# Altium schematic sheet Arduino_Uno_Custom_Schematic.SchDoc (part 3 of 4)
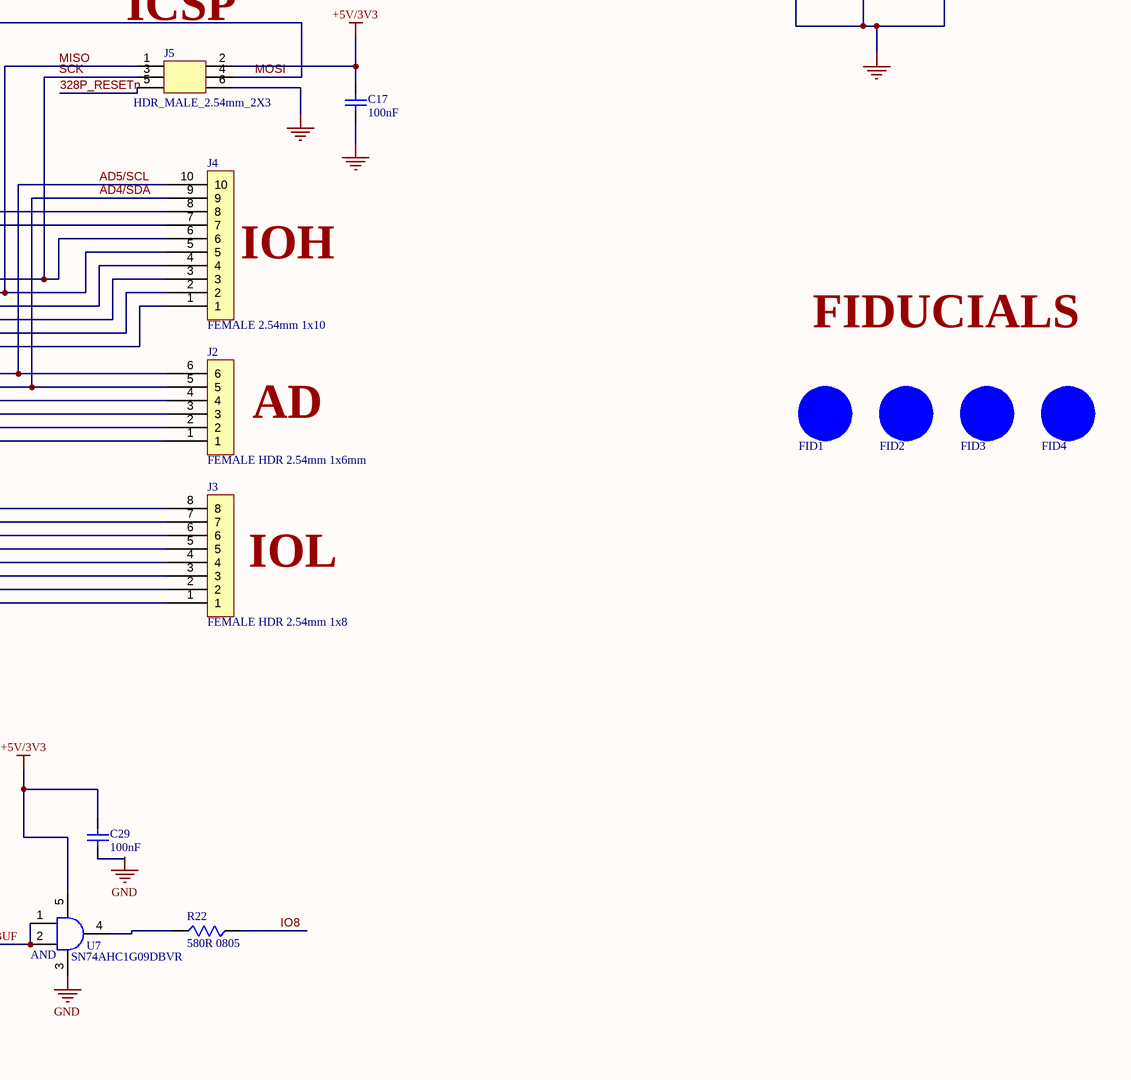
[diagram p5: Arduino_Uno_Custom_Schematic.SchDoc, bottom right]

## Library data of the parts (continued)
JP2 = 77313-124-04LF: Conn Unshrouded Header HDR 4 POS 2.54mm Solder ST Thru-Hole Poly Bag; Manufacturer: Amphenol Communications Solutions; Connector Type: Male Pin; Current Rating: 3A; Dielectric Material: Polyethylene; Gender: Male; Insulation Resistance: 5GΩ; Lead Length: 2.9mm; Mating Post Length: 6.75mm; Max Voltage Rating (AC): 1.5kV; Number of Contacts: 4; Plating Thickness: 762nm; Supplier: DigiKey; Supplier Part Number: 609-77313-124-04LF-ND; Manufacturer Part Number: 77313-124-04LF; RoHS: Compliant; Category: Card Edge Connectors; Stock: 15980; Pricing: 1=0.33, 10=0.283, 100=0.2406, 500=0.21476, 1000=0.2045, 5000=0.18253, 10000=0.17382 (USD); Color: Black; Contact Gender: Male; Contact Material: Bronze; Contact Mating Length: 6.7564mm; Contact Plating: Gold; Depth: 4.83mm; Export Control Classification Number (ECCN) Code: EAR99; Flammability Rating: UL94 V-0; Housing Color: Black; Housing Material: Thermoplastic; Harmonized Tariff Schedule (HTS) Code: 8536.69.40.40; Introduction Date: 2017-02-27; Lead Free: Lead Free; Length: 5.08mm; Lifecycle Status: Production; Material: Thermoplastic; Max Operating Temperature: 130°C; Min Operating Temperature: -65°C; Mounting Technology: Through Hole; Pins: 4; Number of Positions: 4; Number of Rows: 2; Orientation: Straight; Pitch: 2.54mm; Radiation Hardening: No; REACH SVHC: Yes; Row Spacing: 2.54mm; Terminal Pitch: 2.54mm; Termination: Solder; Voltage Rating: 1.5kV; ComponentLink1URL: https://datasheet.octopart.com:443/77313-124-04LF-Amphenol-Communications-Solutions-datasheet-154727349.pdf?src-supplier=IHS; ComponentLink1Description: https://datasheet.octopart.com:443/77313-124-04LF-Amphenol-Communications-Solutions-datasheet-154727349.pdf?src-supplier=IHS; ComponentLink2URL: https://datasheet.octopart.com:443/77313-124-04LF-FCI-datasheet-41338624.pdf?src-supplier=Newark; ComponentLink2Description: https://datasheet.octopart.com:443/77313-124-04LF-FCI-datasheet-41338624.pdf?src-supplier=Newark; ComponentLink3URL: https://datasheet.octopart.com:443/77313-124-04LF-Areva-datasheet-8461548.pdf?src-supplier=Newark; ComponentLink3Description: https://datasheet.octopart.com:443/77313-124-04LF-Areva-datasheet-8461548.pdf?src-supplier=Newark; ComponentLink4URL: https://datasheet.octopart.com:443/77313-124-04LF-Amphenol-Communications-Solutions-datasheet-168215136.pdf?src-supplier=TME; ComponentLink4Description: https://datasheet.octopart.com:443/77313-124-04LF-Amphenol-Communications-Solutions-datasheet-168215136.pdf?src-supplier=TME; ComponentLink5URL: https://datasheet.octopart.com:443/77313-124-04LF-FCI-datasheet-13533417.pdf?src-supplier=element14+APAC; ComponentLink5Description: https://datasheet.octopart.com:443/77313-124-04LF-FCI-datasheet-13533417.pdf?src-supplier=element14+APAC; ComponentLink6URL: https://datasheet.octopart.com:443/77313-124-04LF-Areva-datasheet-118936.pdf?src-supplier=DigiKey; ComponentLink6Description: https://datasheet.octopart.com:443/77313-124-04LF-Areva-datasheet-118936.pdf?src-supplier=DigiKey
JP3 = 68001-104HLF: Conn Unshrouded Header HDR 4 POS 2.54mm Solder ST Top Entry Thru-Hole BERGSTIK® Bulk; Manufacturer: Amphenol Communications Solutions; Connector Type: Male Pin; Current Rating: 3A; Gender: Male; Insulation Resistance: 5GΩ; Lead Length: 3.05mm; Mating Post Length: 5.84mm; Max Voltage Rating (AC): 1.5kV; Number of Contacts: 4; Supplier: DigiKey; Supplier Part Number: 609-3271-ND; Manufacturer Part Number: 68001-104HLF; RoHS: Compliant; Category: Card Edge Connectors; Stock: 16450; Pricing: 1=0.43, 10=0.361, 100=0.307, 500=0.27402, 1000=0.26093, 5000=0.23291, 10000=0.2218 (USD); China RoHS: Compliant; Color: Black; Contact Gender: Male; Contact Material: Bronze; Contact Mating Length: 5.842mm; Contact Plating: Gold; Depth: 2.41mm; Housing Color: Black; Housing Material: Thermoplastic; Lead Pitch: 2.54mm; Length: 10.16mm; Lifecycle Status: Production; Max Operating Temperature: 130°C; Min Operating Temperature: -65°C; Mounting Technology: Through Hole; Pins: 4; Number of Positions: 4; Number of Rows: 1; Orientation: Straight; Pitch: 2.54mm; Radiation Hardening: No; REACH SVHC: Yes; Terminal Pitch: 2.54mm; Termination: Solder; Voltage Rating: 1.5kV; ComponentLink1URL: https://datasheet.octopart.com:443/68001-104HLF-Amphenol-Communications-Solutions-datasheet-151206381.pdf?src-supplier=IHS; ComponentLink1Description: https://datasheet.octopart.com:443/68001-104HLF-Amphenol-Communications-Solutions-datasheet-151206381.pdf?src-supplier=IHS; ComponentLink2URL: https://datasheet.octopart.com:443/68001-104HLF-Areva-datasheet-8449737.pdf?src-supplier=Farnell; ComponentLink2Description: https://datasheet.octopart.com:443/68001-104HLF-Areva-datasheet-8449737.pdf?src-supplier=Farnell; ComponentLink3URL: https://datasheet.octopart.com:443/68001-104HLF-Amphenol-Communications-Solutions-datasheet-41232361.pdf?src-supplier=Farnell; ComponentLink3Description: https://datasheet.octopart.com:443/68001-104HLF-Amphenol-Communications-Solutions-datasheet-41232361.pdf?src-supplier=Farnell; ComponentLink4URL: https://datasheet.octopart.com:443/68001-104HLF-Areva-datasheet-10088795.pdf?src-supplier=Farnell; ComponentLink4Description: https://datasheet.octopart.com:443/68001-104HLF-Areva-datasheet-10088795.pdf?src-supplier=Farnell; ComponentLink5URL: https://datasheet.octopart.com:443/68001-104HLF-Areva-datasheet-8861575.pdf?src-supplier=Farnell; ComponentLink5Description: https://datasheet.octopart.com:443/68001-104HLF-Areva-datasheet-8861575.pdf?src-supplier=Farnell; ComponentLink6URL: https://datasheet.octopart.com:443/68001-104HLF-Areva-datasheet-8713716.pdf?src-supplier=Farnell; ComponentLink6Description: https://datasheet.octopart.com:443/68001-104HLF-Areva-datasheet-8713716.pdf?src-supplier=Farnell; ComponentLink7URL: https://datasheet.octopart.com:443/68001-104HLF-Amphenol-Communications-Solutions-datasheet-154727322.pdf?src-supplier=Electro+Sonic; ComponentLink7Description: https://datasheet.octopart.com:443/68001-104HLF-Amphenol-Communications-Solutions-datasheet-154727322.pdf?src-supplier=Electro+Sonic; ComponentLink8URL: https://datasheet.octopart.com:443/68001-104HLF-Amphenol-Communications-Solutions-datasheet-100449246.pdf?src-supplier=Future+Electronics; ComponentLink8Description: https://datasheet.octopart.com:443/68001-104HLF-Amphenol-Communications-Solutions-datasheet-100449246.pdf?src-supplier=Future+Electronics; ComponentLink9URL: https://datasheet.octopart.com:443/68001-104HLF-Amphenol-Communications-Solutions-datasheet-20739493.pdf?src-supplier=RS+(Formerly+Allied+Electronics); ComponentLink9Description: https://datasheet.octopart.com:443/68001-104HLF-Amphenol-Communications-Solutions-datasheet-20739493.pdf?src-supplier=RS+(Formerly+Allied+Electronics)
L1 = CIGT252008LM2R2MNE: ROHS3Compliant Thin Film Active WRAPAROUND Fixed Inductor -40C~125C 1MHz 97mOhm Max 2.2muH; Manufacturer: Samsung Electro-Mechanics; DC Resistance (DCR): 97mΩ; Value: 2.2µH; Number of Circuits: 1; Shielding: Unshielded; Tolerance: 20%; Supplier: DigiKey; Supplier Part Number: 1276-6925-6-ND; Manufacturer Part Number: CIGT252008LM2R2MNE; RoHS: Compliant; Category: Fixed Inductors; Stock: 51920; Pricing: 1=0.19, 10=0.159, 100=0.1306, 1000=0.10743 (USD); Lifecycle Status: Production; Max Current Rating: 2A; Max Operating Temperature: 125°C; Min Operating Temperature: -40°C; Number of Terminals: 2; REACH SVHC: Yes; Test Frequency: 1MHz; ComponentLink1URL: https://datasheet.octopart.com:443/CIGT252008LM2R2MNE-Samsung-Electro-Mechanics-datasheet-181233562.pdf?src-supplier=IHS; ComponentLink1Description: https://datasheet.octopart.com:443/CIGT252008LM2R2MNE-Samsung-Electro-Mechanics-datasheet-181233562.pdf?src-supplier=IHS; ComponentLink2URL: https://datasheet.octopart.com:443/CIGT252008LM2R2MNE-Samsung-Electro-Mechanics-datasheet-168494664.pdf?src-supplier=Future+Electronics; ComponentLink2Description: https://datasheet.octopart.com:443/CIGT252008LM2R2MNE-Samsung-Electro-Mechanics-datasheet-168494664.pdf?src-supplier=Future+Electronics
LINK1-LINK3 = QPC02SXGN-RC: 2 Position 2.54 mm Centerline Single Circuit Open Top Jumper; Manufacturer: Sullins; Current Rating: 3A; Gender: Female; Number of Contacts: 2; Number of Positions: 1; Pitch: 2.54mm; Supplier: DigiKey; Supplier Part Number: S9337-ND; Manufacturer Part Number: QPC02SXGN-RC; RoHS: Compliant; Category: Shunts and Jumpers; Stock: 1813576; Pricing: 1=0.1, 10=0.028, 25=0.026, 50=0.025, 100=0.0237, 250=0.02224, 500=0.02116, 2000=0.01918, 4000=0.01826 (USD); Case/Package: 100; Contact Material: Brass; Contact Plating: Gold; Height: 6.17mm; Lead Free: Lead Free; Lifecycle Status: Production; Max Operating Temperature: 85°C; Min Operating Temperature: -40°C; Orientation: Straight; Packaging: Bulk; REACH SVHC: Yes; ComponentLink1URL: https://datasheet.octopart.com:443/QPC02SXGN-RC-Sullins-datasheet-138898435.pdf?src-supplier=ODG+(Origin+Data+Global); ComponentLink1Description: https://datasheet.octopart.com:443/QPC02SXGN-RC-Sullins-datasheet-138898435.pdf?src-supplier=ODG+(Origin+Data+Global); ComponentLink2URL: https://datasheet.octopart.com:443/QPC02SXGN-RC-Sullins-datasheet-12521006.pdf?src-supplier=IHS; ComponentLink2Description: https://datasheet.octopart.com:443/QPC02SXGN-RC-Sullins-datasheet-12521006.pdf?src-supplier=IHS; ComponentLink3URL: https://sigma.octopart.com:443/138898456/technical_drawing/Sullins-QPC02SXGN-RC.pdf?src-supplier=Upverter; ComponentLink3Description: https://sigma.octopart.com:443/138898456/technical_drawing/Sullins-QPC02SXGN-RC.pdf?src-supplier=Upverter; ComponentLink4URL: https://datasheet.octopart.com:443/QPC02SXGN-RC-Sullins-datasheet-41399305.pdf?src-supplier=Future+Electronics; ComponentLink4Description: https://datasheet.octopart.com:443/QPC02SXGN-RC-Sullins-datasheet-41399305.pdf?src-supplier=Future+Electronics
MH1-MH3 = MH_7.4MMC_3.2MMD: Mounting Hole, 7.4mm Dia, 3.2mm Drill
MH4 = MH_7.4MMNC_3.2MMD: Mounting Hole 7.4mm (non-copper), 3.2 drill NPTH
R1 = AC0805FR-13100KL: Res Thick Film 0805 100K Ohm 1% 0.125W(1/8W) ±100ppm/C Pad SMD T/R Automotive AEC-Q200; Manufacturer: Yageo Group; Power Rating: 125mW; Value: 100kΩ; Temperature Coefficient: 100ppm/°C; Voltage Rating: 150V; Supplier: DigiKey; Supplier Part Number: 13-AC0805FR-13100KLCT-ND; Manufacturer Part Number: AC0805FR-13100KL; RoHS: Compliant; Category: Chip SMD Resistors; Stock: 276323; Pricing: 1=0.1, 10=0.037, 25=0.028, 50=0.0228, 100=0.0188, 250=0.01484, 500=0.0126, 1000=0.01083, 5000=0.00803 (USD); Case/Package: 0805; China RoHS: Non-Compliant; Composition: Thick Film; Country of Origin: Mainland China, Taiwan; Depth: 1.25mm; Export Control Classification Number (ECCN) Code: EAR99; Height: 500µm; Harmonized Tariff Schedule (HTS) Code: 8533.21.00.30; Introduction Date: 2012-04-10; Length: 2mm; Lifecycle Status: Production; Max Operating Temperature: 155°C; Military Standard: Not; Min Operating Temperature: -55°C; Mounting Technology: Surface Mount; Number of Terminals: 2; Ratings: AEC-Q200; REACH SVHC: Yes; Tolerance: 1%; Width: 1.25mm; Working Voltage: 150V; ComponentLink1URL: https://datasheet.octopart.com:443/AC0805FR-13100KL-Yageo-datasheet-182189377.pdf?src-supplier=IHS; ComponentLink1Description: https://datasheet.octopart.com:443/AC0805FR-13100KL-Yageo-datasheet-182189377.pdf?src-supplier=IHS; ComponentLink2URL: https://datasheet.octopart.com:443/AC0805FR-13100KL-Yageo-datasheet-83209224.pdf?src-supplier=Upverter; ComponentLink2Description: https://datasheet.octopart.com:443/AC0805FR-13100KL-Yageo-datasheet-83209224.pdf?src-supplier=Upverter; ComponentLink3URL: https://datasheet.octopart.com:443/AC0805FR-13100KL-Yageo-datasheet-178509465.pdf?src-supplier=Newark; ComponentLink3Description: https://datasheet.octopart.com:443/AC0805FR-13100KL-Yageo-datasheet-178509465.pdf?src-supplier=Newark; ComponentLink4URL: https://datasheet.octopart.com:443/AC0805FR-13100KL-Yageo-datasheet-166720450.pdf?src-supplier=Future+Electronics; ComponentLink4Description: https://datasheet.octopart.com:443/AC0805FR-13100KL-Yageo-datasheet-166720450.pdf?src-supplier=Future+Electronics; ComponentLink5URL: https://datasheet.octopart.com:443/AC0805FR-13100KL-Yageo-datasheet-151884373.pdf?src-supplier=Future+Electronics; ComponentLink5Description: https://datasheet.octopart.com:443/AC0805FR-13100KL-Yageo-datasheet-151884373.pdf?src-supplier=Future+Electronics; ComponentLink6URL: https://datasheet.octopart.com:443/AC0805FR-13100KL-Yageo-datasheet-137699919.pdf?src-supplier=Future+Electronics; ComponentLink6Description: https://datasheet.octopart.com:443/AC0805FR-13100KL-Yageo-datasheet-137699919.pdf?src-supplier=Future+Electronics; ComponentLink7URL: https://datasheet.octopart.com/AC0805FR-13100KL-Yageo-datasheet-12512238.pdf; ComponentLink7Description: https://datasheet.octopart.com/AC0805FR-13100KL-Yageo-datasheet-12512238.pdf; ComponentLink8URL: http://sigma.octopart.com:80/conflict_mineral_statement/Yageo-company-3.pdf?src-supplier=Compliance+Statements; ComponentLink8Description: http://sigma.octopart.com:80/conflict_mineral_statement/Yageo-company-3.pdf?src-supplier=Compliance+Statements; ComponentLink9URL: http://sigma.octopart.com:80/rohs_statement/Yageo-company-2.pdf?src-supplier=Compliance+Statements; ComponentLink9Description: http://sigma.octopart.com:80/rohs_statement/Yageo-company-2.pdf?src-supplier=Compliance+Statements
R2 R3 R15 R17 R22 = AC0805FR-07560RL: Res Thick Film 0805 560 Ohm 1% 0.125W(1/8W) ±100ppm/C Pad SMD Automotive T/R; Manufacturer: Yageo Group; Manufacturer Package Identifier: 0805 (2012 metric); Max Power Dissipation: 125mW; Value: 560Ω; Temperature Coefficient: 100ppm/°C; Voltage Rating: 150V; Supplier: DigiKey; Supplier Part Number: YAG3743DKR-ND; Manufacturer Part Number: AC0805FR-07560RL; RoHS: Compliant; Category: Chip SMD Resistors; Stock: 36111; Pricing: 1=0.1, 10=0.037, 25=0.028, 50=0.0228, 100=0.0188, 250=0.01484, 500=0.0126, 1000=0.01083 (USD); Case/Package: 0805; Case Code (Imperial): 0805; Case Code (Metric): 2012; China RoHS: Non-Compliant; Composition: Thick Film; Features: Automotive AEC-Q200, Moisture Resistant; Height: 500µm; Length: 2mm; Lifecycle Status: Production; Max Operating Temperature: 155°C; Min Operating Temperature: -55°C; Mounting Technology: Surface Mount; Number of Terminals: 2; Number of Terminations: 2; Packaging: Tape & Reel; Power Rating: 125mW; Ratings: AEC-Q200; REACH SVHC: Yes; Schedule B: 8533210045, 8533210045|8533210045, 8533210045|8533210045|8533210045, 8533210045|8533210045|8533210045|8533210045; Termination: SMD/SMT; Tolerance: 1%; Weight: 5.499807mg; Width: 1.25mm; Working Voltage: 150V; ComponentLink1URL: https://datasheet.octopart.com:443/AC0805FR-07560RL-Yageo-datasheet-182189377.pdf?src-supplier=IHS; ComponentLink1Description: https://datasheet.octopart.com:443/AC0805FR-07560RL-Yageo-datasheet-182189377.pdf?src-supplier=IHS; ComponentLink2URL: https://datasheet.octopart.com:443/AC0805FR-07560RL-Yageo-datasheet-83209224.pdf?src-supplier=Upverter; ComponentLink2Description: https://datasheet.octopart.com:443/AC0805FR-07560RL-Yageo-datasheet-83209224.pdf?src-supplier=Upverter; ComponentLink3URL: https://datasheet.octopart.com:443/AC0805FR-07560RL-Yageo-datasheet-178509465.pdf?src-supplier=Newark; ComponentLink3Description: https://datasheet.octopart.com:443/AC0805FR-07560RL-Yageo-datasheet-178509465.pdf?src-supplier=Newark; ComponentLink4URL: https://datasheet.octopart.com:443/AC0805FR-07560RL-Yageo-Group-datasheet-188689268.pdf?src-supplier=LCSC; ComponentLink4Description: https://datasheet.octopart.com:443/AC0805FR-07560RL-Yageo-Group-datasheet-188689268.pdf?src-supplier=LCSC; ComponentLink5URL: https://datasheet.octopart.com:443/AC0805FR-07560RL-Yageo-datasheet-166720450.pdf?src-supplier=Future+Electronics; ComponentLink5Description: https://datasheet.octopart.com:443/AC0805FR-07560RL-Yageo-datasheet-166720450.pdf?src-supplier=Future+Electronics; ComponentLink6URL: https://datasheet.octopart.com:443/AC0805FR-07560RL-Yageo-datasheet-151884373.pdf?src-supplier=Future+Electronics; ComponentLink6Description: https://datasheet.octopart.com:443/AC0805FR-07560RL-Yageo-datasheet-151884373.pdf?src-supplier=Future+Electronics; ComponentLink7URL: https://datasheet.octopart.com:443/AC0805FR-07560RL-Yageo-datasheet-137699919.pdf?src-supplier=Future+Electronics; ComponentLink7Description: https://datasheet.octopart.com:443/AC0805FR-07560RL-Yageo-datasheet-137699919.pdf?src-supplier=Future+Electronics; ComponentLink8URL: https://datasheet.octopart.com:443/AC0805FR-07560RL-Yageo-datasheet-86786639.pdf?src-supplier=Future+Electronics; ComponentLink8Description: https://datasheet.octopart.com:443/AC0805FR-07560RL-Yageo-datasheet-86786639.pdf?src-supplier=Future+Electronics; ComponentLink9URL: https://datasheet.octopart.com:443/AC0805FR-07560RL-Yageo-datasheet-159083007.pdf?src-supplier=TME; ComponentLink9Description: https://datasheet.octopart.com:443/AC0805FR-07560RL-Yageo-datasheet-159083007.pdf?src-supplier=TME; ComponentLink10URL: https://datasheet.octopart.com:443/AC0805FR-07560RL-Yageo-datasheet-128680628.pdf?src-supplier=X-ON; ComponentLink10Description: https://datasheet.octopart.com:443/AC0805FR-07560RL-Yageo-datasheet-128680628.pdf?src-supplier=X-ON; ComponentLink11URL: https://datasheet.octopart.com/AC0805FR-07560RL-Yageo-datasheet-12512238.pdf; ComponentLink11Description: https://datasheet.octopart.com/AC0805FR-07560RL-Yageo-datasheet-12512238.pdf; ComponentLink12URL: http://sigma.octopart.com:80/conflict_mineral_statement/Yageo-company-3.pdf?src-supplier=Compliance+Statements; ComponentLink12Description: http://sigma.octopart.com:80/conflict_mineral_statement/Yageo-company-3.pdf?src-supplier=Compliance+Statements; ComponentLink13URL: http://sigma.octopart.com:80/rohs_statement/Yageo-company-2.pdf?src-supplier=Compliance+Statements; ComponentLink13Description: http://sigma.octopart.com:80/rohs_statement/Yageo-company-2.pdf?src-supplier=Compliance+Statements
R4 R14 R18-R21 = RC0805FR-0710KL: Res Thick Film 0805 10K Ohm 1% 0.125W(1/8W) +/-100ppm/C Epoxy Pad SMD T/R; Manufacturer: Yageo Group; Max Power Dissipation: 125mW; Value: 10kΩ; Temperature Coefficient: 100ppm/°C; Voltage Rating: 150V; Supplier: DigiKey; Supplier Part Number: 311-10.0KCRCT-ND; Manufacturer Part Number: RC0805FR-0710KL; RoHS: Compliant; Category: Chip SMD Resistors; Stock: 2846345; Pricing: 1=0.13, 10=0.009, 25=0.0088, 50=0.0082 (USD); Case/Package: 0805; Case Code (Imperial): 0805; China RoHS: Non-Compliant; Composition: Thick Film; Country of Origin: Mainland China, Taiwan; Depth: 1.25mm; Export Control Classification Number (ECCN) Code: EAR99; Features: Moisture Resistant; Height: 500µm; Harmonized Tariff Schedule (HTS) Code: 8533.21.00.30; Introduction Date: 2004-09-22; Lead Free: Lead Free; Length: 2mm; Lifecycle Status: Production; Max Operating Temperature: 155°C; Military Standard: Not; Min Operating Temperature: -55°C; Mounting Technology: Surface Mount; Pins: 2; Number of Terminals: 2; Number of Terminations: 2; Packaging: Tape and Reel; Power Dissipation: 125mW; Power Rating: 125mW; REACH SVHC: Yes; Schedule B: 8533210045, 8533210045|8533210045|8533210045|8533210045|8533210045|8533210045|8533210045|8533210045|8533210045|8533210045|8533210045|8533210045|8533210045|8533210045|8533210045|8533210045|8533210045|8533210045|8533210045|8533210045|8533210045|8533210045|8533210045|85; Termination: SMD/SMT; Tolerance: 1%; Voltage Rating (AC): 150V; Width: 1.25mm; Working Voltage: 150V; ComponentLink1URL: https://datasheet.octopart.com:443/RC0805FR-0710KL-Yageo-datasheet-175887523.pdf?src-supplier=Newark; ComponentLink1Description: https://datasheet.octopart.com:443/RC0805FR-0710KL-Yageo-datasheet-175887523.pdf?src-supplier=Newark; ComponentLink2URL: https://datasheet.octopart.com:443/RC0805FR-0710KL-Yageo-datasheet-62067350.pdf?src-supplier=Farnell; ComponentLink2Description: https://datasheet.octopart.com:443/RC0805FR-0710KL-Yageo-datasheet-62067350.pdf?src-supplier=Farnell; ComponentLink3URL: https://datasheet.octopart.com:443/RC0805FR-0710KL-Yageo-datasheet-13691069.pdf?src-supplier=Farnell; ComponentLink3Description: https://datasheet.octopart.com:443/RC0805FR-0710KL-Yageo-datasheet-13691069.pdf?src-supplier=Farnell; ComponentLink4URL: https://datasheet.octopart.com:443/RC0805FR-0710KL-Yageo-datasheet-103092701.pdf?src-supplier=Upverter; ComponentLink4Description: https://datasheet.octopart.com:443/RC0805FR-0710KL-Yageo-datasheet-103092701.pdf?src-supplier=Upverter; ComponentLink5URL: https://datasheet.octopart.com:443/RC0805FR-0710KL-Yageo-datasheet-98239111.pdf?src-supplier=Upverter; ComponentLink5Description: https://datasheet.octopart.com:443/RC0805FR-0710KL-Yageo-datasheet-98239111.pdf?src-supplier=Upverter; ComponentLink6URL: https://datasheet.octopart.com:443/RC0805FR-0710KL-Yageo---Phycomp-datasheet-67302840.pdf?src-supplier=Upverter; ComponentLink6Description: https://datasheet.octopart.com:443/RC0805FR-0710KL-Yageo---Phycomp-datasheet-67302840.pdf?src-supplier=Upverter; ComponentLink7URL: https://datasheet.octopart.com:443/RC0805FR-0710KL-Yageo-datasheet-8330313.pdf?src-supplier=element14+APAC; ComponentLink7Description: https://datasheet.octopart.com:443/RC0805FR-0710KL-Yageo-datasheet-8330313.pdf?src-supplier=element14+APAC; ComponentLink8URL: https://datasheet.octopart.com:443/RC0805FR-0710KL-Yageo-datasheet-12592811.pdf?src-supplier=element14+APAC; ComponentLink8Description: https://datasheet.octopart.com:443/RC0805FR-0710KL-Yageo-datasheet-12592811.pdf?src-supplier=element14+APAC; ComponentLink9URL: https://datasheet.octopart.com:443/RC0805FR-0710KL-Yageo-Group-datasheet-190305687.pdf?src-supplier=Future+Electronics; ComponentLink9Description: https://datasheet.octopart.com:443/RC0805FR-0710KL-Yageo-Group-datasheet-190305687.pdf?src-supplier=Future+Electronics; ComponentLink10URL: https://datasheet.octopart.com:443/RC0805FR-0710KL-Yageo-datasheet-164759695.pdf?src-supplier=Future+Electronics; ComponentLink10Description: https://datasheet.octopart.com:443/RC0805FR-0710KL-Yageo-datasheet-164759695.pdf?src-supplier=Future+Electronics; ComponentLink11URL: https://datasheet.octopart.com:443/RC0805FR-0710KL-Yageo-datasheet-15800360.pdf?src-supplier=Future+Electronics; ComponentLink11Description: https://datasheet.octopart.com:443/RC0805FR-0710KL-Yageo-datasheet-15800360.pdf?src-supplier=Future+Electronics; ComponentLink12URL: https://datasheet.octopart.com:443/RC0805FR-0710KL-Yageo-datasheet-8324252.pdf?src-supplier=Future+Electronics; ComponentLink12Description: https://datasheet.octopart.com:443/RC0805FR-0710KL-Yageo-datasheet-8324252.pdf?src-supplier=Future+Electronics; ComponentLink13URL: https://datasheet.octopart.com:443/RC0805FR-0710KL-Yageo-datasheet-79472498.pdf?src-supplier=Megastar; ComponentLink13Description: https://datasheet.octopart.com:443/RC0805FR-0710KL-Yageo-datasheet-79472498.pdf?src-supplier=Megastar; ComponentLink14URL: https://datasheet.octopart.com:443/RC0805FR-0710KL-Yageo-datasheet-27714392.pdf?src-supplier=Seeed+Studio; ComponentLink14Description: https://datasheet.octopart.com:443/RC0805FR-0710KL-Yageo-datasheet-27714392.pdf?src-supplier=Seeed+Studio; ComponentLink15URL: https://datasheet.octopart.com/RC0805FR-0710KL-Yageo-datasheet-73766026.pdf; ComponentLink15Description: https://datasheet.octopart.com/RC0805FR-0710KL-Yageo-datasheet-73766026.pdf; ComponentLink16URL: https://datasheet.octopart.com:443/RC0805FR-0710KL-Yageo-datasheet-118657.pdf?src-supplier=DigiKey; ComponentLink16Description: https://datasheet.octopart.com:443/RC0805FR-0710KL-Yageo-datasheet-118657.pdf?src-supplier=DigiKey; ComponentLink17URL: https://datasheet.octopart.com:443/RC0805FR-0710KL-Yageo-datasheet-502840.pdf?src-supplier=element14; ComponentLink17Description: https://datasheet.octopart.com:443/RC0805FR-0710KL-Yageo-datasheet-502840.pdf?src-supplier=element14; ComponentLink18URL: http://sigma.octopart.com:80/conflict_mineral_statement/Yageo-company-3.pdf?src-supplier=Compliance+Statements; ComponentLink18Description: http://sigma.octopart.com:80/conflict_mineral_statement/Yageo-company-3.pdf?src-supplier=Compliance+Statements; ComponentLink19URL: http://sigma.octopart.com:80/rohs_statement/Yageo-company-2.pdf?src-supplier=Compliance+Statements; ComponentLink19Description: http://sigma.octopart.com:80/rohs_statement/Yageo-company-2.pdf?src-supplier=Compliance+Statements
R5-R7 R13 R23-R25 = RC0805FR-0722RL: 125mW Thick Film Resistors 150V ±100ppm/℃ ±1% 22Ω 0805 Chip Resistor - Surface Mount ROHS; Manufacturer: Yageo Group; Temperature Coefficient: 100ppm/°C; Supplier: DigiKey; Supplier Part Number: 311-22.0CRCT-ND; Manufacturer Part Number: RC0805FR-0722RL; RoHS: Compliant; Category: Chip SMD Resistors; Stock: 96991; Pricing: 1=0.17, 10=0.015, 25=0.0128, 50=0.0102, 100=0.0092, 250=0.00828 (USD); Case/Package: 0805; Case Code (Imperial): 0805; China RoHS: Non-Compliant; Composition: Thick Film; Country of Origin: Mainland China, Taiwan; Depth: 1.25mm; Export Control Classification Number (ECCN) Code: EAR99; Features: Moisture Resistant; Height: 500µm; Harmonized Tariff Schedule (HTS) Code: 8533.21.00.30; Introduction Date: 2004-09-22; Lead Free: Lead Free; Length: 2mm; Lifecycle Status: Production; Max Operating Temperature: 155°C; Max Power Dissipation: 125mW; Military Standard: Not; Min Operating Temperature: -55°C; Mounting Technology: Surface Mount; Pins: 2; Number of Terminals: 2; Number of Terminations: 2; Packaging: Tape & Reel; Power Dissipation: 125mW; Power Rating: 125mW; REACH SVHC: Yes; Value: 22Ω; Schedule B: 8533210045, 8533210045|8533210045, 8533210045|8533210045|8533210045, 8533210045|8533210045|8533210045|8533210045; Termination: SMD/SMT; Tolerance: 1%; Voltage Rating: 150V; Voltage Rating (AC): 150V; Voltage Rating (DC): 150V; Width: 1.25mm; Working Voltage: 150V; ComponentLink1URL: https://datasheet.octopart.com:443/RC0805FR-0722RL-Yageo-datasheet-175887523.pdf?src-supplier=IHS; ComponentLink1Description: https://datasheet.octopart.com:443/RC0805FR-0722RL-Yageo-datasheet-175887523.pdf?src-supplier=IHS; ComponentLink2URL: https://datasheet.octopart.com:443/RC0805FR-0722RL-Yageo-datasheet-103092701.pdf?src-supplier=Upverter; ComponentLink2Description: https://datasheet.octopart.com:443/RC0805FR-0722RL-Yageo-datasheet-103092701.pdf?src-supplier=Upverter; ComponentLink3URL: https://datasheet.octopart.com:443/RC0805FR-0722RL-Yageo-datasheet-79472498.pdf?src-supplier=Upverter; ComponentLink3Description: https://datasheet.octopart.com:443/RC0805FR-0722RL-Yageo-datasheet-79472498.pdf?src-supplier=Upverter; ComponentLink4URL: https://datasheet.octopart.com:443/RC0805FR-0722RL-Yageo-datasheet-8330313.pdf?src-supplier=element14+APAC; ComponentLink4Description: https://datasheet.octopart.com:443/RC0805FR-0722RL-Yageo-datasheet-8330313.pdf?src-supplier=element14+APAC; ComponentLink5URL: https://datasheet.octopart.com:443/RC0805FR-0722RL-Yageo-datasheet-62067350.pdf?src-supplier=element14+APAC; ComponentLink5Description: https://datasheet.octopart.com:443/RC0805FR-0722RL-Yageo-datasheet-62067350.pdf?src-supplier=element14+APAC; ComponentLink6URL: https://datasheet.octopart.com:443/RC0805FR-0722RL-Yageo-Group-datasheet-176638170.pdf?src-supplier=Future+Electronics; ComponentLink6Description: https://datasheet.octopart.com:443/RC0805FR-0722RL-Yageo-Group-datasheet-176638170.pdf?src-supplier=Future+Electronics; ComponentLink7URL: https://datasheet.octopart.com:443/RC0805FR-0722RL-Yageo-datasheet-164759695.pdf?src-supplier=Future+Electronics; ComponentLink7Description: https://datasheet.octopart.com:443/RC0805FR-0722RL-Yageo-datasheet-164759695.pdf?src-supplier=Future+Electronics; ComponentLink8URL: https://datasheet.octopart.com:443/RC0805FR-0722RL-Yageo-datasheet-12592811.pdf?src-supplier=Future+Electronics; ComponentLink8Description: https://datasheet.octopart.com:443/RC0805FR-0722RL-Yageo-datasheet-12592811.pdf?src-supplier=Future+Electronics; ComponentLink9URL: https://datasheet.octopart.com:443/RC0805FR-0722RL-Yageo-datasheet-8324252.pdf?src-supplier=Future+Electronics; ComponentLink9Description: https://datasheet.octopart.com:443/RC0805FR-0722RL-Yageo-datasheet-8324252.pdf?src-supplier=Future+Electronics; ComponentLink10URL: https://datasheet.octopart.com/RC0805FR-0722RL-Yageo-datasheet-73766026.pdf; ComponentLink10Description: https://datasheet.octopart.com/RC0805FR-0722RL-Yageo-datasheet-73766026.pdf; ComponentLink11URL: https://datasheet.octopart.com:443/RC0805FR-0722RL-Yageo-datasheet-13691069.pdf?src-supplier=Farnell; ComponentLink11Description: https://datasheet.octopart.com:443/RC0805FR-0722RL-Yageo-datasheet-13691069.pdf?src-supplier=Farnell; ComponentLink12URL: https://datasheet.octopart.com:443/RC0805FR-0722RL-Yageo-datasheet-118657.pdf?src-supplier=DigiKey; ComponentLink12Description: https://datasheet.octopart.com:443/RC0805FR-0722RL-Yageo-datasheet-118657.pdf?src-supplier=DigiKey; ComponentLink13URL: http://sigma.octopart.com:80/conflict_mineral_statement/Yageo-company-3.pdf?src-supplier=Compliance+Statements; ComponentLink13Description: http://sigma.octopart.com:80/conflict_mineral_statement/Yageo-company-3.pdf?src-supplier=Compliance+Statements; ComponentLink14URL: http://sigma.octopart.com:80/rohs_statement/Yageo-company-2.pdf?src-supplier=Compliance+Statements; ComponentLink14Description: http://sigma.octopart.com:80/rohs_statement/Yageo-company-2.pdf?src-supplier=Compliance+Statements
R8 R29 = RC0805FR-075K1L: 125Mw Thick Film Resistors 100Ppm/ 1% 5.1K 0805 Chip Resistor Surface Mount Rohs; Manufacturer: Yageo Group; Value: 5.1kΩ; Temperature Coefficient: 100ppm/°C; Voltage Rating: 150V; Supplier: DigiKey; Supplier Part Number: 311-5.10KCRCT-ND; Manufacturer Part Number: RC0805FR-075K1L; RoHS: Compliant; Category: Chip SMD Resistors; Stock: 221866; Pricing: 1=0.1, 10=0.034, 25=0.0256, 50=0.0208, 100=0.0171, 250=0.01344, 500=0.01136, 1000=0.00973 (USD); Case/Package: 0805; Case Code (Imperial): 0805; China RoHS: Non-Compliant; Composition: Thick Film; Contact Plating: Tin; Depth: 1.25mm; Features: Moisture Resistant; Height: 500µm; Lead Free: Lead Free; Length: 2mm; Lifecycle Status: Production; Max Operating Temperature: 155°C; Max Power Dissipation: 125mW; Military Standard: Not; Min Operating Temperature: -55°C; Mounting Technology: Surface Mount; Number of Terminals: 2; Number of Terminations: 2; Packaging: Tape & Reel; Power Rating: 125mW; Radiation Hardening: No; REACH SVHC: Yes; Schedule B: 8533210045, 8533210045|8533210045, 8533210045|8533210045|8533210045, 8533210045|8533210045|8533210045|8533210045; Termination: SMD/SMT; Tolerance: 1%; Voltage Rating (DC): 150V; Width: 1.25mm; Working Voltage: 150V; ComponentLink1URL: https://datasheet.octopart.com:443/RC0805FR-075K1L-Yageo-datasheet-175887523.pdf?src-supplier=Farnell; ComponentLink1Description: https://datasheet.octopart.com:443/RC0805FR-075K1L-Yageo-datasheet-175887523.pdf?src-supplier=Farnell; ComponentLink2URL: https://datasheet.octopart.com:443/RC0805FR-075K1L-Yageo-datasheet-103092701.pdf?src-supplier=Upverter; ComponentLink2Description: https://datasheet.octopart.com:443/RC0805FR-075K1L-Yageo-datasheet-103092701.pdf?src-supplier=Upverter; ComponentLink3URL: https://datasheet.octopart.com:443/RC0805FR-075K1L-Yageo-Group-datasheet-190305687.pdf?src-supplier=Future+Electronics; ComponentLink3Description: https://datasheet.octopart.com:443/RC0805FR-075K1L-Yageo-Group-datasheet-190305687.pdf?src-supplier=Future+Electronics; ComponentLink4URL: https://datasheet.octopart.com:443/RC0805FR-075K1L-Yageo-datasheet-164759695.pdf?src-supplier=Future+Electronics; ComponentLink4Description: https://datasheet.octopart.com:443/RC0805FR-075K1L-Yageo-datasheet-164759695.pdf?src-supplier=Future+Electronics; ComponentLink5URL: https://datasheet.octopart.com:443/RC0805FR-075K1L-Yageo-datasheet-12592811.pdf?src-supplier=Future+Electronics; ComponentLink5Description: https://datasheet.octopart.com:443/RC0805FR-075K1L-Yageo-datasheet-12592811.pdf?src-supplier=Future+Electronics; ComponentLink6URL: https://datasheet.octopart.com:443/RC0805FR-075K1L-Yageo-datasheet-8324252.pdf?src-supplier=Future+Electronics; ComponentLink6Description: https://datasheet.octopart.com:443/RC0805FR-075K1L-Yageo-datasheet-8324252.pdf?src-supplier=Future+Electronics; ComponentLink7URL: https://datasheet.octopart.com:443/RC0805FR-075K1L-Yageo-datasheet-8330313.pdf?src-supplier=Burklin+Elektronik; ComponentLink7Description: https://datasheet.octopart.com:443/RC0805FR-075K1L-Yageo-datasheet-8330313.pdf?src-supplier=Burklin+Elektronik; ComponentLink8URL: https://datasheet.octopart.com:443/RC0805FR-075K1L-Yageo-Group-datasheet-189192902.pdf?src-supplier=LCSC; ComponentLink8Description: https://datasheet.octopart.com:443/RC0805FR-075K1L-Yageo-Group-datasheet-189192902.pdf?src-supplier=LCSC; ComponentLink9URL: https://datasheet.octopart.com/RC0805FR-075K1L-Yageo-datasheet-73766026.pdf; ComponentLink9Description: https://datasheet.octopart.com/RC0805FR-075K1L-Yageo-datasheet-73766026.pdf; ComponentLink10URL: https://datasheet.octopart.com:443/RC0805FR-075K1L-Yageo-datasheet-118657.pdf?src-supplier=DigiKey; ComponentLink10Description: https://datasheet.octopart.com:443/RC0805FR-075K1L-Yageo-datasheet-118657.pdf?src-supplier=DigiKey; ComponentLink11URL: http://sigma.octopart.com:80/conflict_mineral_statement/Yageo-company-3.pdf?src-supplier=Compliance+Statements; ComponentLink11Description: http://sigma.octopart.com:80/conflict_mineral_statement/Yageo-company-3.pdf?src-supplier=Compliance+Statements; ComponentLink12URL: http://sigma.octopart.com:80/rohs_statement/Yageo-company-2.pdf?src-supplier=Compliance+Statements; ComponentLink12Description: http://sigma.octopart.com:80/rohs_statement/Yageo-company-2.pdf?src-supplier=Compliance+Statements
R9 R16 = RT0805FRE071ML: 125mW Thin Film Resistor ±50ppm/℃ ±1% 1MΩ 0805 Chip Resistor - Surface Mount ROHS; Manufacturer: Yageo Group; Temperature Coefficient: 50ppm/°C; Voltage Rating: 150V; Supplier: DigiKey; Supplier Part Number: YAG3361CT-ND; Manufacturer Part Number: RT0805FRE071ML; RoHS: Compliant; Category: Chip SMD Resistors; Stock: 39342; Pricing: 1=0.1, 10=0.016, 25=0.016, 50=0.0154, 100=0.0143, 250=0.01324, 500=0.01194 (USD); Case/Package: 0805; Case Code (Imperial): 0805; China RoHS: Non-Compliant; Composition: Thin Film; Country of Origin: Mainland China, Taiwan; Export Control Classification Number (ECCN) Code: EAR99; Features: Moisture Resistant; Height: 500µm; Harmonized Tariff Schedule (HTS) Code: 8533.21.00.30; Introduction Date: 2008-07-11; Lead Free: Lead Free; Length: 2mm; Lifecycle Status: Production; Max Operating Temperature: 155°C; Max Power Dissipation: 125mW; Min Operating Temperature: -55°C; Mounting Technology: Surface Mount; Pins: 2; Number of Terminals: 2; Number of Terminations: 2; Power Dissipation: 125mW; Power Rating: 125mW; REACH SVHC: Yes; Value: 1MΩ; Schedule B: 8533210045, 8533210045|8533210045|8533210045|8533210045|8533210045, 8533210045|8533210045|8533210045|8533210045|8533210045|8533210045, 8533210045|8533210045|8533210045|8533210045|8533210045|8533210045|8533210045; Termination: SMD/SMT; Tolerance: 1%; Voltage Rating (DC): 150V; Width: 1.25mm; Working Voltage: 150V; ComponentLink1URL: https://datasheet.octopart.com:443/RT0805FRE071ML-Yageo-datasheet-176402239.pdf?src-supplier=Future+Electronics; ComponentLink1Description: https://datasheet.octopart.com:443/RT0805FRE071ML-Yageo-datasheet-176402239.pdf?src-supplier=Future+Electronics; ComponentLink2URL: https://datasheet.octopart.com:443/RT0805FRE071ML-Yageo-datasheet-169971040.pdf?src-supplier=Future+Electronics; ComponentLink2Description: https://datasheet.octopart.com:443/RT0805FRE071ML-Yageo-datasheet-169971040.pdf?src-supplier=Future+Electronics; ComponentLink3URL: https://datasheet.octopart.com:443/RT0805FRE071ML-Yageo-datasheet-166250672.pdf?src-supplier=Future+Electronics; ComponentLink3Description: https://datasheet.octopart.com:443/RT0805FRE071ML-Yageo-datasheet-166250672.pdf?src-supplier=Future+Electronics; ComponentLink4URL: https://datasheet.octopart.com:443/RT0805FRE071ML-Yageo-datasheet-136673517.pdf?src-supplier=Future+Electronics; ComponentLink4Description: https://datasheet.octopart.com:443/RT0805FRE071ML-Yageo-datasheet-136673517.pdf?src-supplier=Future+Electronics; ComponentLink5URL: https://datasheet.octopart.com:443/RT0805FRE071ML-Yageo-datasheet-137700930.pdf?src-supplier=Future+Electronics; ComponentLink5Description: https://datasheet.octopart.com:443/RT0805FRE071ML-Yageo-datasheet-137700930.pdf?src-supplier=Future+Electronics; ComponentLink6URL: https://datasheet.octopart.com:443/RT0805FRE071ML-Yageo-datasheet-96443642.pdf?src-supplier=Future+Electronics; ComponentLink6Description: https://datasheet.octopart.com:443/RT0805FRE071ML-Yageo-datasheet-96443642.pdf?src-supplier=Future+Electronics; ComponentLink7URL: https://datasheet.octopart.com:443/RT0805FRE071ML-Yageo-datasheet-83209228.pdf?src-supplier=Future+Electronics; ComponentLink7Description: https://datasheet.octopart.com:443/RT0805FRE071ML-Yageo-datasheet-83209228.pdf?src-supplier=Future+Electronics; ComponentLink8URL: https://datasheet.octopart.com:443/RT0805FRE071ML-Yageo-Group-datasheet-188167888.pdf?src-supplier=TME; ComponentLink8Description: https://datasheet.octopart.com:443/RT0805FRE071ML-Yageo-Group-datasheet-188167888.pdf?src-supplier=TME; ComponentLink9URL: https://datasheet.octopart.com:443/RT0805FRE071ML-Yageo-Group-datasheet-141265893.pdf?src-supplier=ODG+(Origin+Data+Global); ComponentLink9Description: https://datasheet.octopart.com:443/RT0805FRE071ML-Yageo-Group-datasheet-141265893.pdf?src-supplier=ODG+(Origin+Data+Global); ComponentLink10URL: https://datasheet.octopart.com:443/RT0805FRE071ML-Yageo-datasheet-8324589.pdf?src-supplier=Farnell; ComponentLink10Description: https://datasheet.octopart.com:443/RT0805FRE071ML-Yageo-datasheet-8324589.pdf?src-supplier=Farnell; ComponentLink11URL: https://datasheet.octopart.com/RT0805FRE071ML-Yageo-datasheet-86813807.pdf; ComponentLink11Description: https://datasheet.octopart.com/RT0805FRE071ML-Yageo-datasheet-86813807.pdf; ComponentLink12URL: http://sigma.octopart.com:80/conflict_mineral_statement/Yageo-company-3.pdf?src-supplier=Compliance+Statements; ComponentLink12Description: http://sigma.octopart.com:80/conflict_mineral_statement/Yageo-company-3.pdf?src-supplier=Compliance+Statements; ComponentLink13URL: http://sigma.octopart.com:80/rohs_statement/Yageo-company-2.pdf?src-supplier=Compliance+Statements; ComponentLink13Description: http://sigma.octopart.com:80/rohs_statement/Yageo-company-2.pdf?src-supplier=Compliance+Statements
R10-R12 = RC0805FR-071KL: Yageo RC0805FR-071KL SMD Resistor 0603 1k Ohm ±1% Thick Film; Manufacturer: Yageo Group; Max Power Dissipation: 125mW; Value: 1kΩ; Temperature Coefficient: 100ppm/°C; Voltage Rating: 150V; Supplier: DigiKey; Supplier Part Number: 311-1.00KCRCT-ND; Manufacturer Part Number: RC0805FR-071KL; RoHS: Compliant; Category: Chip SMD Resistors; Stock: 704785; Pricing: 1=0.1, 10=0.008 (USD); Case/Package: 0805; Case Code (Imperial): 0805; China RoHS: Non-Compliant; Composition: Thick Film; Country of Origin: Mainland China, Taiwan; Depth: 1.25mm; Export Control Classification Number (ECCN) Code: EAR99; Features: Moisture Resistant; Height: 500µm; Harmonized Tariff Schedule (HTS) Code: 8533.21.00.30; Introduction Date: 2004-09-22; Lead Free: Lead Free; Length: 2mm; Lifecycle Status: Production; Max Operating Temperature: 155°C; Military Standard: Not; Min Operating Temperature: -55°C; Mounting Technology: Surface Mount; Pins: 2; Number of Terminals: 2; Number of Terminations: 2; Packaging: Tape & Reel; Power Dissipation: 125mW; Power Rating: 125mW; REACH SVHC: Yes; Schedule B: 8533210045, 8533210045|8533210045, 8533210045|8533210045|8533210045, 8533210045|8533210045|8533210045|8533210045; Termination: SMD/SMT; Tolerance: 1%; Voltage Rating (AC): 150V; Voltage Rating (DC): 150V; Width: 1.25mm; Working Voltage: 150V; ComponentLink1URL: https://datasheet.octopart.com:443/RC0805FR-071KL-Yageo-datasheet-175887523.pdf?src-supplier=IHS; ComponentLink1Description: https://datasheet.octopart.com:443/RC0805FR-071KL-Yageo-datasheet-175887523.pdf?src-supplier=IHS; ComponentLink2URL: https://datasheet.octopart.com:443/RC0805FR-071KL-Yageo-datasheet-103092701.pdf?src-supplier=Upverter; ComponentLink2Description: https://datasheet.octopart.com:443/RC0805FR-071KL-Yageo-datasheet-103092701.pdf?src-supplier=Upverter; ComponentLink3URL: https://datasheet.octopart.com:443/RC0805FR-071KL-Yageo-datasheet-8330313.pdf?src-supplier=element14+APAC; ComponentLink3Description: https://datasheet.octopart.com:443/RC0805FR-071KL-Yageo-datasheet-8330313.pdf?src-supplier=element14+APAC; ComponentLink4URL: https://datasheet.octopart.com:443/RC0805FR-071KL-Yageo-datasheet-62067350.pdf?src-supplier=element14+APAC; ComponentLink4Description: https://datasheet.octopart.com:443/RC0805FR-071KL-Yageo-datasheet-62067350.pdf?src-supplier=element14+APAC; ComponentLink5URL: https://datasheet.octopart.com:443/RC0805FR-071KL-Yageo-datasheet-12592811.pdf?src-supplier=element14+APAC; ComponentLink5Description: https://datasheet.octopart.com:443/RC0805FR-071KL-Yageo-datasheet-12592811.pdf?src-supplier=element14+APAC; ComponentLink6URL: https://datasheet.octopart.com:443/RC0805FR-071KL-Yageo-Group-datasheet-190305687.pdf?src-supplier=Newark; ComponentLink6Description: https://datasheet.octopart.com:443/RC0805FR-071KL-Yageo-Group-datasheet-190305687.pdf?src-supplier=Newark; ComponentLink7URL: https://datasheet.octopart.com:443/RC0805FR-071KL-Yageo-Group-datasheet-176638170.pdf?src-supplier=Future+Electronics; ComponentLink7Description: https://datasheet.octopart.com:443/RC0805FR-071KL-Yageo-Group-datasheet-176638170.pdf?src-supplier=Future+Electronics; ComponentLink8URL: https://datasheet.octopart.com:443/RC0805FR-071KL-Yageo-datasheet-164759695.pdf?src-supplier=Future+Electronics; ComponentLink8Description: https://datasheet.octopart.com:443/RC0805FR-071KL-Yageo-datasheet-164759695.pdf?src-supplier=Future+Electronics; ComponentLink9URL: https://datasheet.octopart.com:443/RC0805FR-071KL-Yageo-datasheet-8324252.pdf?src-supplier=Future+Electronics; ComponentLink9Description: https://datasheet.octopart.com:443/RC0805FR-071KL-Yageo-datasheet-8324252.pdf?src-supplier=Future+Electronics; ComponentLink10URL: https://datasheet.octopart.com:443/RC0805FR-071KL-Yageo-datasheet-79472498.pdf?src-supplier=Megastar; ComponentLink10Description: https://datasheet.octopart.com:443/RC0805FR-071KL-Yageo-datasheet-79472498.pdf?src-supplier=Megastar; ComponentLink11URL: https://datasheet.octopart.com/RC0805FR-071KL-Yageo-datasheet-73766026.pdf; ComponentLink11Description: https://datasheet.octopart.com/RC0805FR-071KL-Yageo-datasheet-73766026.pdf; ComponentLink12URL: https://datasheet.octopart.com:443/RC0805FR-071KL-Yageo-datasheet-13691069.pdf?src-supplier=Farnell; ComponentLink12Description: https://datasheet.octopart.com:443/RC0805FR-071KL-Yageo-datasheet-13691069.pdf?src-supplier=Farnell; ComponentLink13URL: https://datasheet.octopart.com:443/RC0805FR-071KL-Yageo-datasheet-118657.pdf?src-supplier=DigiKey; ComponentLink13Description: https://datasheet.octopart.com:443/RC0805FR-071KL-Yageo-datasheet-118657.pdf?src-supplier=DigiKey; ComponentLink14URL: https://datasheet.octopart.com:443/RC0805FR-071KL-Yageo-datasheet-502840.pdf?src-supplier=element14; ComponentLink14Description: https://datasheet.octopart.com:443/RC0805FR-071KL-Yageo-datasheet-502840.pdf?src-supplier=element14; ComponentLink15URL: http://sigma.octopart.com:80/conflict_mineral_statement/Yageo-company-3.pdf?src-supplier=Compliance+Statements; ComponentLink15Description: http://sigma.octopart.com:80/conflict_mineral_statement/Yageo-company-3.pdf?src-supplier=Compliance+Statements; ComponentLink16URL: http://sigma.octopart.com:80/rohs_statement/Yageo-company-2.pdf?src-supplier=Compliance+Statements; ComponentLink16Description: http://sigma.octopart.com:80/rohs_statement/Yageo-company-2.pdf?src-supplier=Compliance+Statements
R26-R28 = CR0805AJ/-000EAS: Zero Ohm Resistor, Jumper, 0805 [2012 Metric], Thick Film, 125 mW, 2 A, Surface Mount Device; Manufacturer: Bourns; Power Rating: 125mW; Value: 0Ω; Temperature Coefficient: 400ppm/°C; Tolerance: 5%; Voltage Rating: 150V; Supplier: DigiKey; Supplier Part Number: CR0805AJ/-000EASCT-ND; Manufacturer Part Number: CR0805AJ/-000EAS; RoHS: Compliant; Category: Chip SMD Resistors; Stock: 68321; Pricing: 1=0.1, 10=0.039, 25=0.0296, 50=0.024, 100=0.0199, 250=0.01576, 500=0.01342, 1000=0.01156 (USD); Case/Package: 0805; China RoHS: Non-Compliant; Composition: Thick Film; Country of Origin: Taiwan; Export Control Classification Number (ECCN) Code: EAR99; Height: 500µm; Harmonized Tariff Schedule (HTS) Code: 8533.21.00.30; Introduction Date: 2019-05-31; Length: 2mm; Lifecycle Status: Production; Max Operating Temperature: 155°C; Min Operating Temperature: -55°C; Mounting Technology: Surface Mount; Number of Terminals: 2; Ratings: AEC-Q200; REACH SVHC: Yes; Voltage Rating (DC): 150V; Width: 1.25mm; ComponentLink1URL: https://datasheet.octopart.com:443/CR0805AJ--000EAS-Bourns-datasheet-181955238.pdf?src-supplier=IHS; ComponentLink1Description: https://datasheet.octopart.com:443/CR0805AJ--000EAS-Bourns-datasheet-181955238.pdf?src-supplier=IHS; ComponentLink2URL: https://datasheet.octopart.com:443/CR0805AJ--000EAS-Bourns-datasheet-181955240.pdf?src-supplier=IHS; ComponentLink2Description: https://datasheet.octopart.com:443/CR0805AJ--000EAS-Bourns-datasheet-181955240.pdf?src-supplier=IHS; ComponentLink3URL: https://datasheet.octopart.com:443/CR0805AJ--000EAS-Bourns-datasheet-166097895.pdf?src-supplier=Electro+Sonic; ComponentLink3Description: https://datasheet.octopart.com:443/CR0805AJ--000EAS-Bourns-datasheet-166097895.pdf?src-supplier=Electro+Sonic; ComponentLink4URL: https://datasheet.octopart.com:443/CR0805AJ--000EAS-Bourns-datasheet-136430691.pdf?src-supplier=Electro+Sonic; ComponentLink4Description: https://datasheet.octopart.com:443/CR0805AJ--000EAS-Bourns-datasheet-136430691.pdf?src-supplier=Electro+Sonic; ComponentLink5URL: https://datasheet.octopart.com:443/CR0805AJ--000EAS-Bourns-datasheet-177039331.pdf?src-supplier=Burklin+Elektronik; ComponentLink5Description: https://datasheet.octopart.com:443/CR0805AJ--000EAS-Bourns-datasheet-177039331.pdf?src-supplier=Burklin+Elektronik; ComponentLink6URL: http://sigma.octopart.com:80/conflict_mineral_statement/Bourns-company-36.pdf?src-supplier=Compliance+Statements; ComponentLink6Description: http://sigma.octopart.com:80/conflict_mineral_statement/Bourns-company-36.pdf?src-supplier=Compliance+Statements
SCKT_FOR_U1 = 4828-3004-CP: 3M DIP28socket DILsocket, 4800series, 2.54mmPitch, 7.62mmrow width, Through hole mounting; Connector Type: DIP, Socket; Current Rating: 1A; Gender: Female; Insulation Resistance: 5GΩ; Number of Contacts: 28; Pitch: 2.54mm; Row Spacing: 7.62mm; Supplier: DigiKey; Supplier Part Number: 3M5480-ND; Manufacturer: 3M; Manufacturer Part Number: 4828-3004-CP; RoHS: Compliant; Category: Connectors; Stock: 6938; Pricing: 1=1.68, 14=1.39, 28=1.32357, 56=1.26018, 112=1.19991, 252=1.13313, 504=1.07905, 1008=1.02754, 2506=0.96361 (USD); China RoHS: Compliant; Contact Material: Bronze; Contact Plating: Tin; Depth: 5.08mm; Export Control Classification Number (ECCN) Code: EAR99; Housing Material: Glass; Harmonized Tariff Schedule (HTS) Code: 8536.69.40.40; Introduction Date: 2011-04-19; Lead Free: Lead Free; Length: 35.43mm; Lifecycle Status: Production; Max Operating Temperature: 85°C; Min Operating Temperature: -25°C; Mounting Technology: Through Hole; Pins: 28; Number of Positions: 28; Number of Rows: 2; Orientation: Straight; REACH SVHC: Yes; Terminal Pitch: 2.54mm; Termination: Solder; Width: 10.16mm; ComponentLink1URL: https://datasheet.octopart.com:443/4828-3004-CP-3M-datasheet-11754339.pdf?src-supplier=element14+APAC; ComponentLink1Description: https://datasheet.octopart.com:443/4828-3004-CP-3M-datasheet-11754339.pdf?src-supplier=element14+APAC; ComponentLink2URL: https://datasheet.octopart.com:443/4828-3004-CP-3M-datasheet-125432.pdf?src-supplier=Verical; ComponentLink2Description: https://datasheet.octopart.com:443/4828-3004-CP-3M-datasheet-125432.pdf?src-supplier=Verical; ComponentLink3URL: https://datasheet.octopart.com:443/4828-3004-CP-3M-datasheet-110561487.pdf?src-supplier=RS+(Formerly+Allied+Electronics); ComponentLink3Description: https://datasheet.octopart.com:443/4828-3004-CP-3M-datasheet-110561487.pdf?src-supplier=RS+(Formerly+Allied+Electronics); ComponentLink4URL: https://datasheet.octopart.com:443/4828-3004-CP-3M-datasheet-12002015.pdf?src-supplier=RS+(Formerly+Allied+Electronics); ComponentLink4Description: https://datasheet.octopart.com:443/4828-3004-CP-3M-datasheet-12002015.pdf?src-supplier=RS+(Formerly+Allied+Electronics); ComponentLink5URL: http://sigma.octopart.com:80/conflict_mineral_statement/3M-company-24.pdf?src-supplier=Compliance+Statements; ComponentLink5Description: http://sigma.octopart.com:80/conflict_mineral_statement/3M-company-24.pdf?src-supplier=Compliance+Statements